# Altium schematic sheet PLC-无线通讯版-显示板-V2.SchDoc
size A4
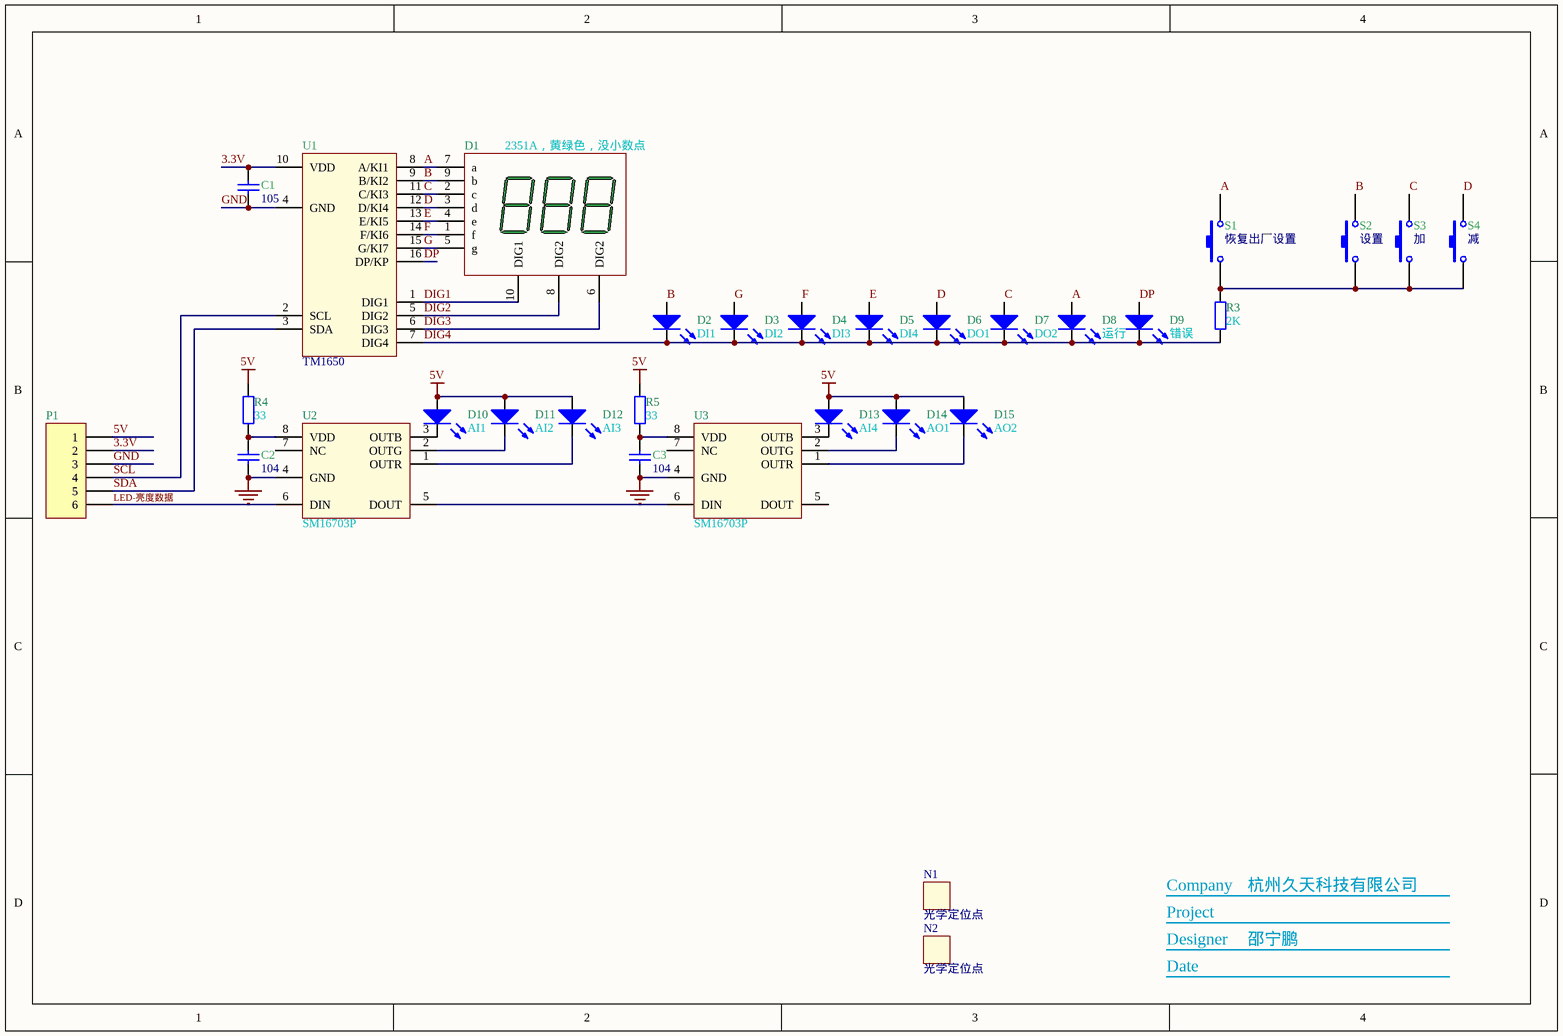
[diagram p0: PLC-无线通讯版-显示板-V2.SchDoc]

## Parts
C1  105  [C-0603]
C2  104  [C-0603]
C3  104  [C-0603]
D1  2351A，黄绿色，没小数点  [3位0.25英寸]
D2  DI1  [LED-0603-GREEN]
D3  DI2  [LED-0603-GREEN]
D4  DI3  [LED-0603-GREEN]
D5  DI4  [LED-0603-GREEN]
D6  DO1  [LED-0603-GREEN]
D7  DO2  [LED-0603-GREEN]
D8  运行  [LED-0603-Blue]
D9  错误  [LED-0603-Red]
D10  AI1  [LED-0603-GREEN]
D11  AI2  [LED-0603-GREEN]
D12  AI3  [LED-0603-GREEN]
D13  AI4  [LED-0603-GREEN]
D14  AO1  [LED-0603-GREEN]
D15  AO2  [LED-0603-GREEN]
N1  光学定位点  [MARK-1mm-3mm]
N2  光学定位点  [MARK-1mm-3mm]
P1  (no value)  [PH2.0-6AW]
R3  2K  [R-0603]
R4  33  [R-0603]
R5  33  [R-0603]
S1  恢复出厂设置  [SB-6*6*9.5_贴片]
S2  设置  [SB-6*6*9.5_贴片]
S3  加  [SB-6*6*9.5_贴片]
S4  减  [SB-6*6*9.5_贴片]
U1  TM1650  [SOP-16-M]
U2  SM16703P  [SOP-8-M]
U3  SM16703P  [SOP-8-M]

## Nets
5V: D10.1(A) D11.1(A) D12.1(A) D13.1(A) D14.1(A) D15.1(A) P1.1 R4.1 R5.1
GND: C1.1 C2.1 C3.1 P1.3 U1.4(GND) U2.4(GND) U3.4(GND)
3.3V: C1.2 P1.2 U1.10(VDD)
A: D1.7(a) D8.1(A) S1.2 U1.8(A/KI1)
B: D1.9(b) D2.1(A) S2.2 U1.9(B/KI2)
C: D1.2(c) D7.1(A) S3.2 U1.11(C/KI3)
D: D1.3(d) D6.1(A) S4.2 U1.12(D/KI4)
DIG1: D1.10(DIG1) U1.1(DIG1)
DIG2: D1.8(DIG2) U1.5(DIG2)
DIG3: D1.6(DIG2) U1.6(DIG3)
DIG4: D2.2(K) D3.2(K) D4.2(K) D5.2(K) D6.2(K) D7.2(K) D8.2(K) D9.2(K) R3.2 U1.7(DIG4)
DP: D9.1(A) U1.16(DP/KP)
E: D1.4(e) D5.1(A) U1.13(E/KI5)
F: D1.1(f) D4.1(A) U1.14(F/KI6)
G: D1.5(g) D3.1(A) U1.15(G/KI7)
LED-亮度数据: P1.6 U2.6(DIN)
SCL: P1.4 U1.2(SCL)
SDA: P1.5 U1.3(SDA)
NetC2_2: C2.2 R4.2 U2.8(VDD)
NetC3_2: C3.2 R5.2 U3.8(VDD)
NetD10_2: D10.2(K) U2.3(OUTB)
NetD11_2: D11.2(K) U2.2(OUTG)
NetD12_2: D12.2(K) U2.1(OUTR)
NetD13_2: D13.2(K) U3.3(OUTB)
NetD14_2: D14.2(K) U3.2(OUTG)
NetD15_2: D15.2(K) U3.1(OUTR)
NetR3_1: R3.1 S1.1 S2.1 S3.1 S4.1
NetU2_5: U2.5(DOUT) U3.6(DIN)

Not connected (* = marked no-connect by the designer): U2 7(NC); U3 5(DOUT) 7(NC)

## Notes on the sheet
- Project
- Company
- 杭州久天科技有限公司
- Designer
- Date
- 邵宁鹏

## Library data of the parts
C1-C3 = Cap: Capacitor; Published: 8-Jun-2000; LatestRevisionDate: 17-Jul-2002; LatestRevisionNote: Re-released for DXP Platform.; PackageReference: RAD-0.3; Publisher: Altium Limited
D1 = 3位数码管-无点-2351A
D2-D15 = LED-0603-Blue: Published: 8-Jun-2000; LatestRevisionDate: 08-Jul-2005; LatestRevisionNote: Mech Layer 1 removed.; PackageReference: LED-0; Publisher: Altium Limited
N1 N2 = 无引脚
P1 = Header 6: Header, 6-Pin; LatestRevisionDate: 17-Jul-2002; LatestRevisionNote: Re-released for DXP Platform.; Publisher: Altium Limited
R3-R5 = Res2-0603: 0603; Published: 8-Jun-2000; LatestRevisionDate: 17-Jul-2002; LatestRevisionNote: Re-released for DXP Platform.; PackageReference: AXIAL-0.4; Publisher: Altium Limited
S1-S4 = SB-6*6*9: SB-6*6*10; Published: 24-Mar-1999; LatestRevisionDate: 17-Jul-2002; LatestRevisionNote: Re-released for DXP Platform.; PackageReference: SPST-2; Publisher: Altium Limited
U1 = TM1650: 共阴数码管驱动器